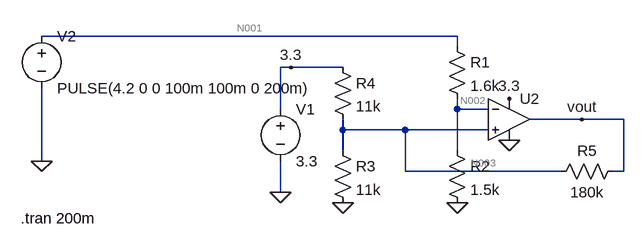
[diagram p0: schematic comparator-test.asc]
comparator-test.asc, the LTspice schematic file:
Version 4
SHEET 1 880 680
WIRE 128 48 -512 48
WIRE 128 64 128 48
WIRE -128 96 -144 96
WIRE -48 96 -128 96
WIRE -144 160 -144 96
WIRE 128 160 128 144
WIRE 176 160 128 160
WIRE 320 176 240 176
WIRE 384 176 320 176
WIRE -48 192 -48 176
WIRE 48 192 -48 192
WIRE 176 192 48 192
WIRE -48 224 -48 192
WIRE 128 224 128 160
WIRE -512 240 -512 128
WIRE 48 256 48 192
WIRE 288 256 48 256
WIRE 384 256 384 176
WIRE 384 256 368 256
WIRE -144 288 -144 240
FLAG 128 304 0
FLAG -48 304 0
FLAG -144 288 0
FLAG 208 208 0
FLAG -128 96 3.3
FLAG 208 144 3.3
FLAG 320 176 vout
FLAG -512 240 0
SYMBOL res 112 48 R0
SYMATTR InstName R1
SYMATTR Value 1.6k
SYMBOL res 112 208 R0
SYMATTR InstName R2
SYMATTR Value 1.5k
SYMBOL res -64 208 R0
SYMATTR InstName R3
SYMATTR Value 11k
SYMBOL res -64 80 R0
SYMATTR InstName R4
SYMATTR Value 11k
SYMBOL voltage -144 144 R0
WINDOW 123 0 0 Left 0
WINDOW 39 0 0 Left 0
SYMATTR InstName V1
SYMATTR Value 3.3
SYMBOL voltage -512 32 R0
WINDOW 123 0 0 Left 0
WINDOW 39 0 0 Left 0
SYMATTR InstName V2
SYMATTR Value PULSE(4.2 0 0 100m 100m 0 200m)
SYMBOL OpAmps\\UniversalOpAmp2 208 176 R0
SYMATTR InstName U2
SYMBOL res 384 240 R90
WINDOW 0 0 56 VBottom 2
WINDOW 3 32 56 VTop 2
SYMATTR InstName R5
SYMATTR Value 180k
TEXT -544 328 Left 2 !.tran 200m

The netlist it stands for:
* comparator-test.asc
R1 N001 N002 1.6k
R2 N002 0 1.5k
R3 N003 0 11k
R4 3.3 N003 11k
V1 3.3 0 3.3
V2 N001 0 PULSE(4.2 0 0 100m 100m 0 200m)
XU2 N003 N002 3.3 0 vout level2 Avol=1Meg GBW=10Meg Slew=10Meg Ilimit=25m Rail=0 Vos=0 En=0 Enk=0 In=0 Ink=0 Rin=500Meg  ; pins In+ In- V+ V- OUT
R5 vout N003 180k
.tran 200m
.lib UniversalOpAmp2.lib
.backanno
.end

* Results of the author's LTspice run, read from the files saved beside the schematic
* Operating Point, zero values left out:
*   V(n001) = 4.2 V
*   V(n002) = 2.032 V
*   V(n003) = 1.601 V
*   V(3.3) = 3.3 V
*   V(vout) = 95.68 µV
*   I(R5) = -8.894 µA
*   I(R4) = 154.4 µA
*   I(R3) = 145.6 µA
*   I(R2) = 1.355 mA
*   I(R1) = 1.355 mA
*   I(V2) = -1.355 mA
*   I(V1) = -154.9 µA
*   Ix(u2:1) = -97.84 pA
*   Ix(u2:2) = 764.5 pA
*   Ix(u2:3) = 423.7 nA
*   Ix(u2:4) = -9.177 µA
*   Ix(u2:5) = 8.894 µA
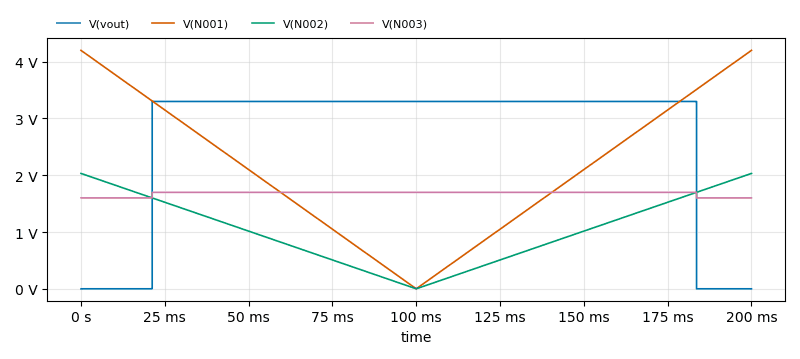
[diagram p1: Transient Analysis of comparator-test.asc, plotted from the saved traces]
* Transient Analysis, 1 run:
*   V(vout): min 95.5 µV, max 3.3 V, average 2.679 V, rms 2.973 V, last 95.66 µV
*   V(N001): min 0 V, max 4.2 V, average 2.1 V, rms 2.505 V, last 4.2 V
*   V(N002): min 2.555 µV, max 2.032 V, average 1.016 V, rms 1.212 V, last 2.032 V
*   V(N003): min 1.601 V, max 1.699 V, average 1.681 V, rms 1.681 V, last 1.601 V